# Altium schematic sheet Nordic.SchDoc: Shaheen PCB Board
size A3; Author: Mattia Sinigaglia; CompanyName: University of Bologna; DrawnBy: Mattia Sinigaglia; Organization: EES - Micrel Lab; Revision: v1; SheetNumber: 4; SheetTotal: 6
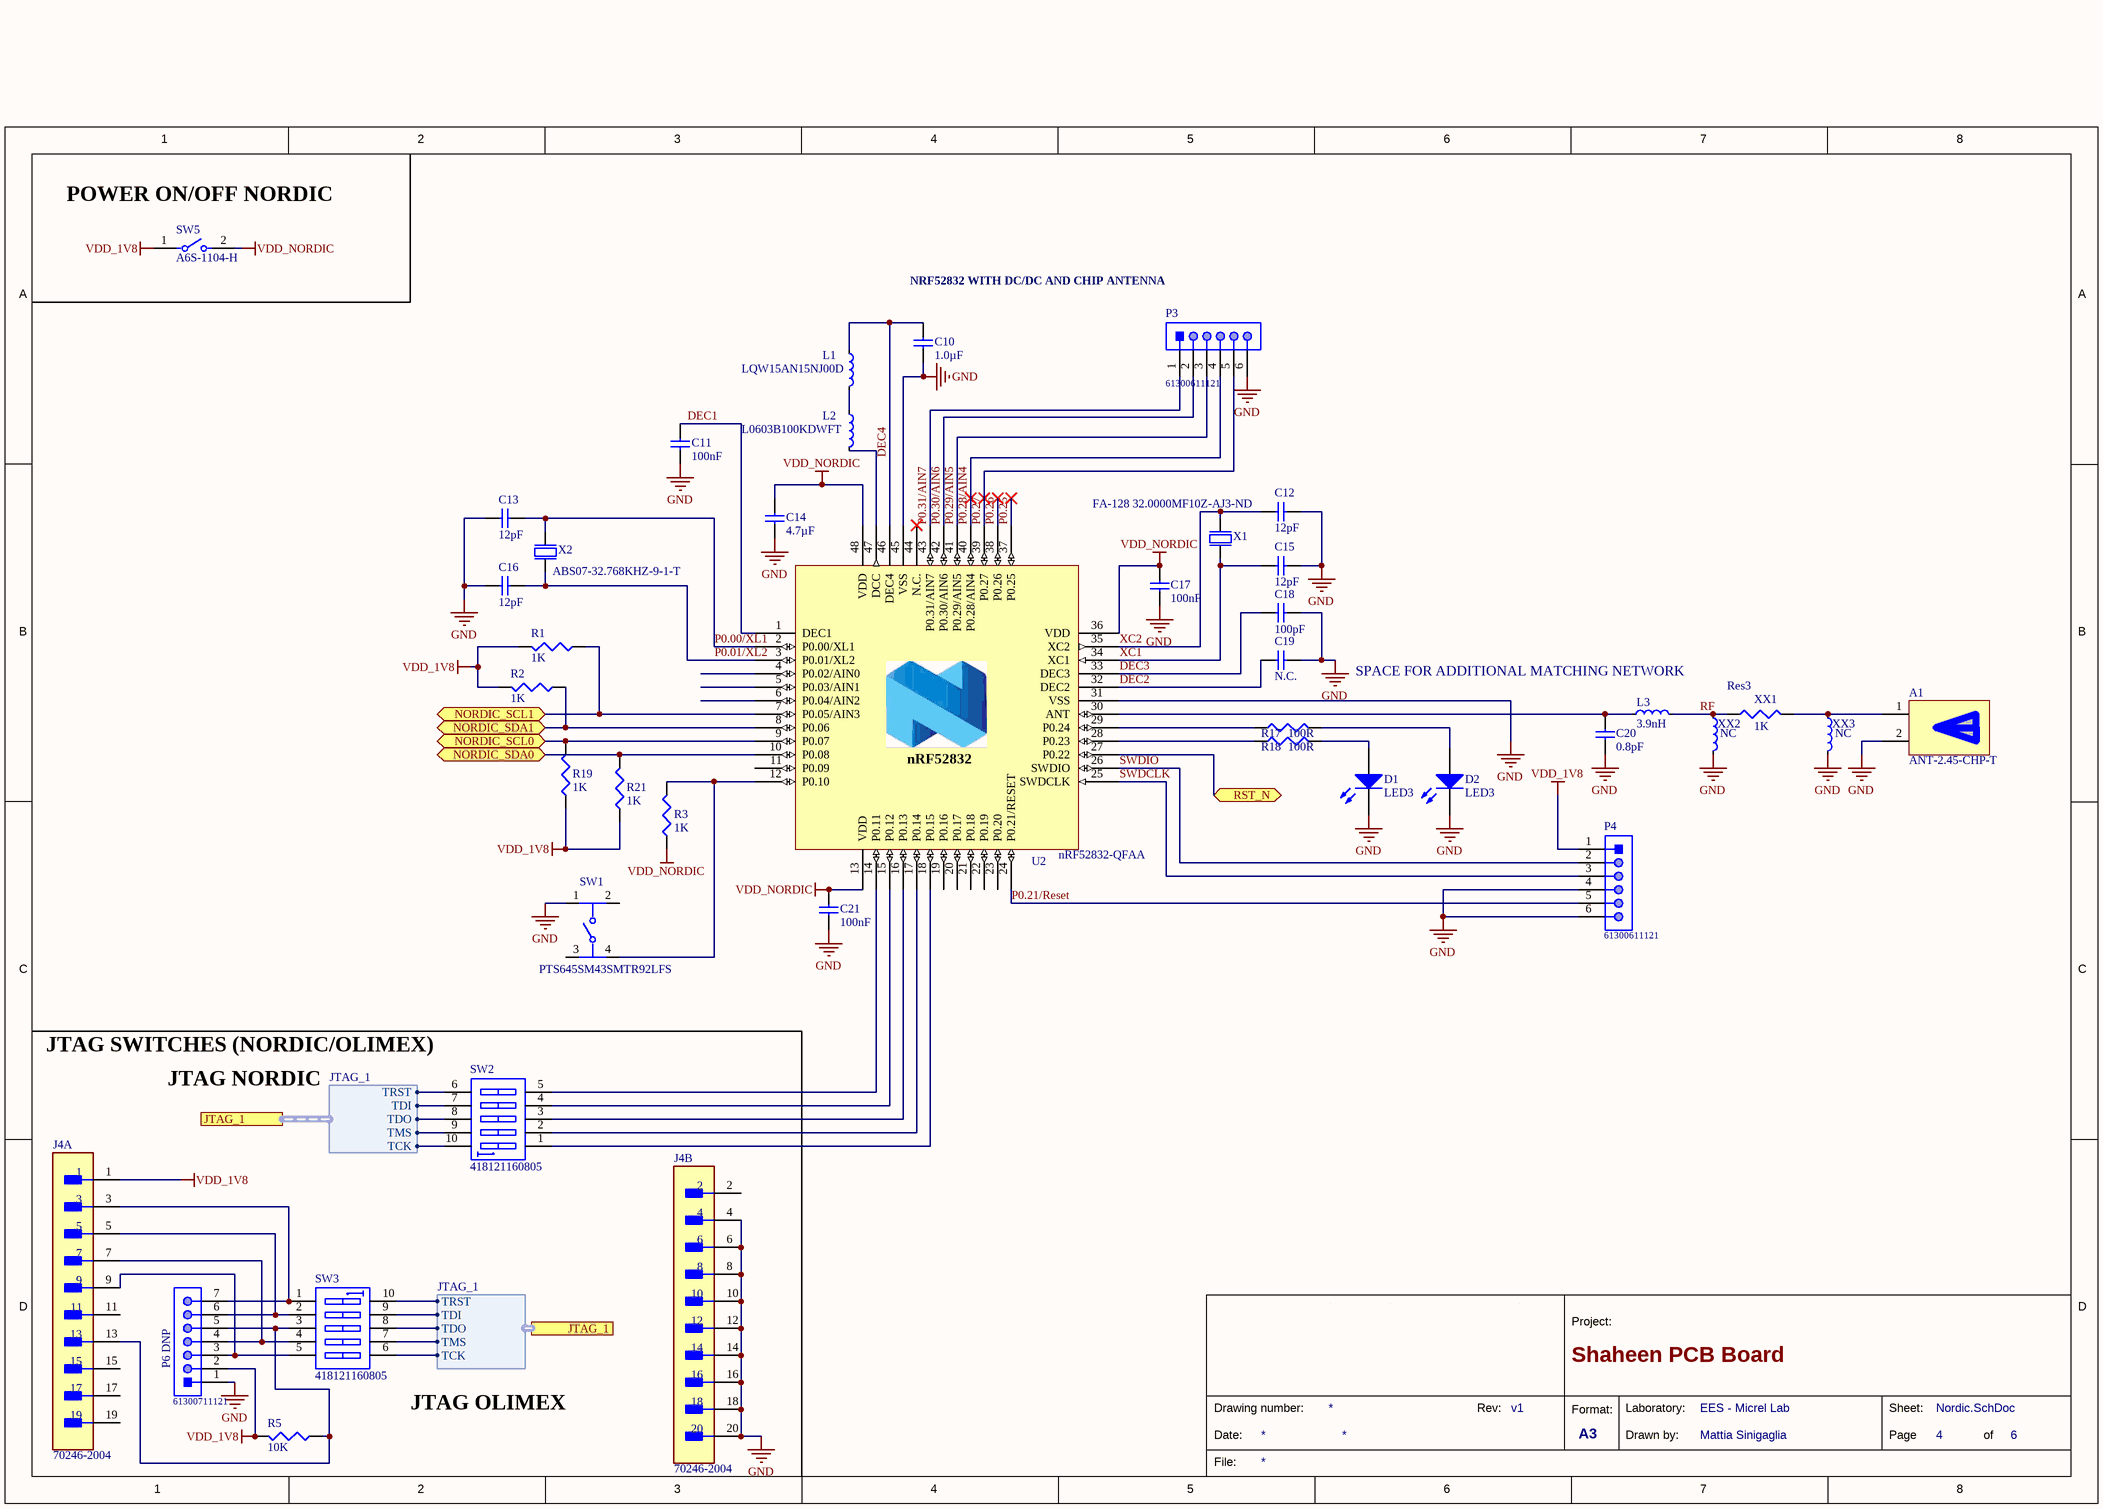
[diagram p0: Nordic.SchDoc]

## Parts
A1  ANT-2.45-CHP-T  [ANTENNACHIP]
C10  1.0µF  [CAPC1608X06L]
C11  100nF  [CAPC1005X04L]
C12  12pF  [CAPC1005X04L]
C13  12pF  [CAPC1005X04L]
C14  4.7µF  [CAPC1608X06L]
C15  12pF  [CAPC1005X04L]
C16  12pF  [CAPC1005X04L]
C17  100nF  [CAPC1005X04L]
C18  100pF  [CAPC1005X04L]
C19  N.C.  [CAPC1005X04L]
C20  0.8pF  [CAPC1005X04L]
C21  100nF  [CAPC1005X04L]
D1  LED3  [0603]
D2  LED3  [0603]
J4  70246-2004  [FP-70246-2004-MFG]  (parts A,B of 2)
L1  LQW15AN15NJ00D  [INDC1005X04L]
L2  L0603B100KDWFT  [J1-0603]
L3  3.9nH  [INDC1005X04L]
P3  61300611121  [61300611121]
P4  61300611121  [61300611121]
P6_DNP  61300711121  [61300711121]
R1  value 1K  [J1-0603]  (hidden comment: 0R)
R2  value 1K  [J1-0603]  (hidden comment: 0R)
R3  value 1K  [J1-0603]  (hidden comment: 0R)
R5  value 10K  [J1-0603]  (hidden comment: 0R)
R17  value 100R  [J1-0603]  (hidden comment: Res3)
R18  value 100R  [J1-0603]  (hidden comment: Res3)
R19  value 1K  [J1-0603]  (hidden comment: 0R)
R21  value 1K  [J1-0603]  (hidden comment: 0R)
SW1  PTS645SM43SMTR92LFS  [FP-PTS645SM43SMTR92LFS-MFG]
SW2  418121160805  [418121160805]
SW3  418121160805  [418121160805]
SW5  A6S-1104-H  [FP-A6S-1104-H-MFG]
U2  nRF52832-QFAA  [QFN40P600X600X90-48N]
X1  FA-128 32.0000MF10Z-AJ3-ND  [BT-XTAL_2016]
X2  ABS07-32.768KHZ-9-1-T  [ABS07-32.768KHZ-9-1-T]
XX1  Res3  value 1K  [J1-0603]
XX2  NC  [INDC1005X04L]
XX3  NC  [INDC1005X04L]

## Ports
JTAG_1 (harness JTAG_1), NORDIC_SCL0 (bidir), NORDIC_SCL1 (bidir), NORDIC_SDA0 (bidir), NORDIC_SDA1 (bidir), RST_N (bidir)

## Harnesses
JTAG_1: TRST, TDI, TDO, TMS, TCK

## Nets
GND: A1.2(NC) C10.1 C11.2 C12.2 C13.2 C14.2 C15.2 C16.2 C17.2 C18.2 C19.1 C20.1 C21.2 D1.2(K) D2.2(K) J4.4 J4.6 J4.8 J4.10 J4.12 J4.14 J4.16 J4.18 J4.20 P3.6 P4.4 P4.6 P6_DNP.1 SW1.1 U2.31(VSS) U2.45(VSS) U2.49(GND) X1.2(GND) X1.4(GND) XX2.2 XX3.2
VDD_1V8: J4.1 P4.1 P6_DNP.2 R1.1 R2.1 R5.1 R19.2 R21.2 SW5.1
VDD_NORDIC: C14.1 C17.1 C21.1 R3.2 SW5.2 U2.13(VDD) U2.36(VDD) U2.48(VDD)
DEC1: C11.1 U2.1(DEC1)
DEC2: C19.2 U2.32(DEC2)
DEC3: C18.1 U2.33(DEC3)
DEC4: C10.2 L1.1 U2.46(DEC4)
NORDIC_SCL0: R19.1 U2.9(P0.07) ; port NORDIC_SCL0
NORDIC_SCL1: R1.2 U2.7(P0.05/AIN3) ; port NORDIC_SCL1
NORDIC_SDA0: R21.1 U2.10(P0.08) ; port NORDIC_SDA0
NORDIC_SDA1: R2.2 U2.8(P0.06) ; port NORDIC_SDA1
P0.00/XL1: C13.1 U2.2(P0.00/XL1) X2.1(inp)
P0.01/XL2: C16.1 U2.3(P0.01/XL2) X2.2(out)
P0.21/Reset: P4.5 U2.24(P0.21/RESET)
P0.25: U2.37(P0.25)
P0.26: U2.38(P0.26)
P0.27: P3.5 U2.39(P0.27)
P0.28/AIN4: P3.4 U2.40(P0.28/AIN4)
P0.29/AIN5: P3.3 U2.41(P0.29/AIN5)
P0.30/AIN6: P3.2 U2.42(P0.30/AIN6)
P0.31/AIN7: P3.1 U2.43(P0.31/AIN7)
RF: L3.2 XX1.1 XX2.1
RST_N: U2.27(P0.22) ; port RST_N
SWDCLK: P4.3 U2.25(SWDCLK)
SWDIO: P4.2 U2.26(SWDIO)
XC1: C15.1 U2.34(XC1) X1.1(inp)
XC2: C12.1 U2.35(XC2) X1.3(out)
NetA1_1: A1.1(IN) XX1.2 XX3.1
NetC20_2: C20.2 L3.1 U2.30(ANT)
NetD1_1: D1.1(A) R18.2
NetD2_1: D2.1(A) R17.2
NetJ4_3: J4.3 P6_DNP.7 SW3.1
NetJ4_5: J4.5 P6_DNP.6 SW3.2
NetJ4_7: J4.7 P6_DNP.4 SW3.4
NetJ4_9: J4.9 P6_DNP.3 SW3.5
NetJ4_13: J4.13 P6_DNP.5 R5.2 SW3.3
NetL1_2: L1.2 L2.1
NetL2_2: L2.2 U2.47(DCC)
NetR3_1: R3.1 SW1.4 U2.12(P0.10)
NetR17_1: R17.1 U2.29(P0.24)
NetR18_1: R18.1 U2.28(P0.23)
NetSW2_1: SW2.1 U2.18(P0.15)
NetSW2_2: SW2.2 U2.17(P0.14)
NetSW2_3: SW2.3 U2.16(P0.13)
NetSW2_4: SW2.4 U2.15(P0.12)
NetSW2_5: SW2.5 U2.14(P0.11)
NetSW2_6: SW2.6 SW3.10 ; port JTAG_1.TRST
NetSW2_7: SW2.7 SW3.9 ; port JTAG_1.TDI
NetSW2_8: SW2.8 SW3.8 ; port JTAG_1.TDO
NetSW2_9: SW2.9 SW3.7 ; port JTAG_1.TMS
NetSW2_10: SW2.10 SW3.6 ; port JTAG_1.TCK

Not connected (* = marked no-connect by the designer): J4 2 11 15 17 19; SW1 2 3; U2 4(P0.02/AIN0) 5(P0.03/AIN1) 6(P0.04/AIN2) 11(P0.09) 19(P0.16) 20(P0.17) 21(P0.18) 22(P0.19) 23(P0.20) 44(N.C.)*

## Notes on the sheet
- (near SW5) POWER ON/OFF NORDIC
- NRF52832 WITH DC/DC AND CHIP ANTENNA
- SPACE FOR ADDITIONAL MATCHING NETWORK
- JTAG SWITCHES (NORDIC/OLIMEX)
- JTAG NORDIC
- JTAG OLIMEX
- 1
- 2
- 3
- 4
- 5
- 6
- 7
- 8
- A
- B
- C
- D
- Project:
- Date:
- Drawing number:
- Rev:
- Format:
- A3
- Drawn by:
- Laboratory:
- Page
- Sheet:
- of
- File:
- (in symbol nRF52832-QFAB) nRF52832

## Library data of the parts
A1 = Linx ANT-2.45-CHP-x: Amtenna; Manufacturer: Linx; Supplier PN: ANT-2.45-CHPCT-ND; Supplier: Digikey; Manufacturer PN: ANT-2.45-CHP-T
C10 = C0603-1µ0: Capacitor, X7R, ±10%; Note: 16V; Artikkelnr Noca: 20039335; Artikkelnr Simpro: N.A.; Part Number: C0603-1µ0; Manufacturer: *; Manufacturer Part Number: *; Datasheet: *; LatestRevisionDate: 2013-06-05; Pin Count: 2; Publisher: Nordic Semiconductor; Published: 2009-05-08; Value: 1.0µF; Supplier: *; Supplier part number: *; 2nd source Supplier: *; 2nd source part number: *; Footprint Doc: 0603
C11 C17 C21 = C0402-100n: Capacitor, X7R, ±10%; Note: 16V; Artikkelnr Noca: 20039200; Artikkelnr Simpro: N.A.; Part Number: C0402-100n; Manufacturer: *; Manufacturer Part Number: *; Datasheet: *; LatestRevisionDate: 2009-11-23; Pin Count: 2; Publisher: Nordic Semiconductor; Published: 2009-05-08; Value: 100nF; Supplier: *; Supplier part number: *; 2nd source Supplier: *; 2nd source part number: *; Footprint Doc: 0402
C12 C13 C15 C16 = C0402-12p: Capacitor, NP0, ±2%; Note: 50V; Artikkelnr Noca: 20029159; Artikkelnr Simpro: N.A.; Part Number: C0402-12p; Manufacturer: *; Manufacturer Part Number: *; Datasheet: *; LatestRevisionDate: 2011-05-11; Pin Count: 2; Publisher: Nordic Semiconductor; Published: 2009-05-08; Value: 12pF; Supplier: *; Supplier part number: *; 2nd source Supplier: *; 2nd source part number: *; Footprint Doc: 0402
C14 = C0603-4µ7: Capacitor, X5R, ±10%; Note: 6.3V; Artikkelnr Noca: 20069060; Artikkelnr Simpro: N.A.; Part Number: C0603-4µ7; Manufacturer: *; Manufacturer Part Number: *; Datasheet: *; LatestRevisionDate: 2009-11-23; Pin Count: 2; Publisher: Nordic Semiconductor; Published: 2009-05-08; Value: 4.7µF; Supplier: *; Supplier part number: *; 2nd source Supplier: *; 2nd source part number: *; Footprint Doc: 0603
C18 = C0402-100p: Capacitor, NP0, ±5%; Note: 50V; Artikkelnr Noca: 20029135; Artikkelnr Simpro: N.A.; Part Number: C0402-100p; Manufacturer: *; Manufacturer Part Number: *; Datasheet: *; LatestRevisionDate: 2009-05-08; Pin Count: 2; Publisher: Nordic Semiconductor; Published: 2009-05-08; Value: 100pF; Supplier: *; Supplier part number: *; 2nd source Supplier: *; 2nd source part number: *; Footprint Doc: 0402
C19 = C0402-N.C.: Not mounted; Note: Chip Cap; Artikkelnr Noca: N.A.; Part Number: C0402-N.C.; Manufacturer: *; Manufacturer Part Number: *; Datasheet: *; LatestRevisionDate: 2009-05-08; Pin Count: 2; Publisher: Nordic Semiconductor; Published: 2009-05-08; Value: N.C.; Supplier: *; Supplier part number: *; 2nd source Supplier: *; 2nd source part number: *; Footprint Doc: 0402; Artikkelnr Simpro: N.A.
C20 = C0402-0.8p: Capacitor, NP0, ±5%; Note: 50V; Artikkelnr Noca: 20029147; Artikkelnr Simpro: N.A.; Part Number: C0402-0.8p; Manufacturer: *; Manufacturer Part Number: *; Datasheet: *; LatestRevisionDate: 2012-11-21; Pin Count: 2; Publisher: Nordic Semiconductor; Published: 2009-05-08; Value: 0.8pF; Supplier: *; Supplier part number: *; 2nd source Supplier: *; 2nd source part number: *; Footprint Doc: 0402
D1 D2 = LED3: Typical BLUE SiC LED; Published: 8-Jun-2000; LatestRevisionDate: 17-Dec-2003; LatestRevisionNote: PCB Footprint replaced.; DatasheetVersion: 16-Apr-2002; PackageVersion: 16-Apr-2002; PackageReference: 3.5X2.8X1.9; Publisher: Altium Limited; PackageDescription: SM LED; 2 C-Bend Leads; Body 3.5 x 2.8 x 1.9 mm, inc leads (LxWxH typ)
J4 = CMP-04776-000337-1: CONN HEADER VERT 20POS 2.54MM; Voltage Rating (DC): 250V; Number of Contacts: 20; Current Rating: 2.5A; Glow Wire Compliant: Non-compliant; Gender: Male; Termination: Solder; Min Operating Temperature: -55°C; Voltage Rating: 250V; Series: 70246; Orientation: Vertical; Radiation Hardening: No; Contact Material: Gold; Number of Circuits: 20; Packaging: Tray; Flammability Rating: UL94 V-0; Contact Plating: Gold; Max Voltage Rating (DC): 250V; Package Quantity: 720; ELV: Compliant; Max Operating Temperature: 120°C; Number of Positions: 20; Number of Rows: 2; Pitch: 2.54mm; Mount: Through Hole
L1 = L0402-15n: High frequency chip inductor ±10%; Manufacturer: Taiyo Yuden; Manufacturer Part Number: HK100515NJ-T; 2nd source part number: 658-1328; Value: 15nH; Artikkelnr Noca: 33029323; Artikkelnr Simpro: N.A.; Part Number: L0402-15n; LatestRevisionDate: 2012-09-19; Pin Count: 2; Publisher: Nordic Semiconductor; Published: 2010-07-12; Note: High frequency chip inductor ±10%; Supplier: Digi-Key; Datasheet: http://www.yuden.co.jp/productdata/catalog/en/mlci04_e.pdf; Supplier part number: 587-1521-1-ND; 2nd source Supplier: Farnell; Footprint Doc: 0402
L2 = L0603-10µ: Chip inductor, IDC,min = 50 mA, ±20%; Manufacturer: Taiyo Yuden; Manufacturer Part Number: LBMF1608T100K; 2nd source part number: 178-6105; Value: 10µH; Note: LBMF1608T100K 10µH 80mA 0603; Artikkelnr Noca: 33029314; Artikkelnr Simpro: N.A.; Part Number: L0603-10µ; Datasheet: http://www.yuden.co.jp/ut/product/pdf/elb2_e.pdf; LatestRevisionDate: 2012-09-19; Pin Count: 2; Publisher: Nordic Semiconductor; Published: 2010-02-24; Supplier: Digi-Key; Supplier part number: 587-1714-1-ND; 2nd source Supplier: Farnell; Footprint Doc: 0603
L3 = L0402-3n9: High frequency chip inductor ±5%; Manufacturer: Murata; Manufacturer Part Number: LQP15MN3N9B02D; Artikkelnr Noca: 33029151; Artikkelnr Simpro: N.A.; Part Number: L0402-3n9; Datasheet: http://search.murata.co.jp/Ceramy/image/img/PDF/ENG/L0075S0084LQP15M.pdf; LatestRevisionDate: 2012-09-19; Pin Count: 2; Publisher: Nordic Semiconductor; Published: 2009-05-08; Value: 3.9nH; Note: High frequency chip inductor ±5%; Supplier: Digi-Key; Supplier part number: 490-1131-1-ND; 2nd source Supplier: *; 2nd source part number: *; Footprint Doc: 0402
P3 P4 = CMP-1502-01070-1: THT Vertical Pin Header WR-PHD, Pitch 2.54 mm, Single Row, 6 pins; Manufacturer: Wurth Elektronik; Gender: Male; Pin Number: 6; Pitch: 2.54mm; Working Voltage: 250VAC; Rated Current: 3A; Withstanding Voltage: 500VAC; Contact Resistance: 20mOhm; Operating Temperature: -40to105degC; Packaging: Bag; Datasheet URL: https://katalog.we-online.de/em/datasheet/6130xx11121.pdf; Package Reference: 61300611121; Mounting Technology: THT; Publisher: WurthElektronik; Part Number: 61300611121; Manufacturer URL: http://www.we-online.de; Row Number: Single; Orientation: Vertical
P6_DNP = CMP-1502-01074-1: THT Vertical Pin Header WR-PHD, Pitch 2.54 mm, Single Row, 7 pins; Manufacturer: Wurth Elektronik; Pin Number: 7; Gender: Male; Working Voltage: 250VAC; Contact Resistance: 20mOhm; Rated Current: 3A; Pitch: 2.54mm; Withstanding Voltage: 500VAC; Row Number: Single; Packaging: Bag; Orientation: Vertical; Manufacturer URL: http://www.we-online.de; Datasheet URL: https://katalog.we-online.de/em/datasheet/6130xx11121.pdf; Part Number: 61300711121; Publisher: WurthElektronik; Operating Temperature: -40to105degC; Mounting Technology: THT; Package Reference: 61300711121
R1-R3 R5 R17-R19 R21 XX1 = Res3: Resistor; Published: 8-Jun-2000; LatestRevisionDate: 29-May-2009; LatestRevisionNote: IPC-7351 Footprint Added.; PackageReference: J1-0603; Publisher: Altium Limited; PackageDescription: Chip Resistor
SW1 = CMP-2000-05160-2: SWITCH TACTILE SPST-NO 0.05A 12V; Contact Resistance: 100mR; Throw Configuration: SPST; Illumination Type: Non-Illuminated; Mechanical Life: 100000Cycles; Current Rating: 50mA; Switch Function: Off-Mom; Actuator Length: 0.85mm; Actuator Material: Nylon; Actuator Type: Standard; Operating Force: 160gf; Min Operating Temperature: -20°C; REACH SVHC: No SVHC; Termination: Gull Wing; Case/Package: SMD/SMT; Packaging: Tape and Reel; Mount: Surface Mount; Voltage Rating (DC): 12V; Orientation: Straight; Lead Free: Lead Free; Contact Material: Silver; Color: Black; Max Current Rating: 50mA; Contact Plating: Silver; Depth: 9mm; Package Quantity: 1; Max Voltage Rating (DC): 12V; Length: 6mm; Max Operating Temperature: 60°C
SW2 SW3 = CMP-1437-00005-1: WS-DISV 2.54 mm small compact SMD Dip Switch with top tape; Manufacturer: Wuerth Elektronik; NoPins: 10; ComponentLink1Description: Manufacturer URL; ComponentLink1URL: http://www.we-online.com; ComponentLink2Description: Datasheet; ComponentLink2URL: http://katalog.we-online.de/em/datasheet/4181211608xx.pdf; PackageReference: 418121160805; PartNumber: 418121160805
SW5 = CMP-08827-000005-1: SWITCH SLIDE DIP SPST 25MA 24V; Manufacturer: Omron Electronics Inc-EMC Div; Throw Configuration: SPST-NO; Standoff Height: 0mm; Number Of Circuits: 1; Electromechanical Life: 1000Cycles; Contact Resistance: 200mΩ; Digikey Description: SWITCH SLIDE DIP SPST 25MA 24V; ComponentLink2Description: Datasheet; Mount: Surface Mount; Manufacturer Part Number: A6S-1104-H; ComponentLink2URL: https://omronfs.omron.com/en_US/ecb/products/pdf/en-a6s.pdf; Category: Switch; Height: 3.95mm; Device Class L3: DIP Switches; Octopart: https://octopart.com/a6s-1104-h-omron-55410938; Mouser Description: DIP Switches / SIP Switches Dip Switch; Lead Free: Yes; Temperature Range Low: -20°C; Temperature Range High: +70°C; Automotive: No; Ambient Temperature Range Low: -20°C; Ambient Temperature Range High: +70°C; Voltage Rating Dc: 24V; Device Class L2: Switches; RoHS: TRUE; Package: 0; Contact Current Rating: 25mA; Device Class L1: Electromechanical; Temperature: -20°C to +70°C
U2 = nRF52832-QFAB: Multi-protocol Bluetooth Low Energy, ANT and 2.4GHz proprietary system-on-chip; Manufacturer: Nordic Semiconductor; Artikkelnr Noca: N.A.; Part Number: nRF52832-QFAA; Manufacturer Part Number: nRF52832-QFAA; Datasheet: *; LatestRevisionDate: 2016-11-24; Pin Count: 48; Publisher: Nordic Semiconductor; Published: 2016-11-24; Value: nRF52832-QFAA; Note: *; Supplier: Nordic Semiconductor; Supplier part number: *; 2nd source Supplier: *; 2nd source part number: *; Footprint Doc: QFN-48; Artikkelnr Simpro: N.A.
X1 = XTAL_SMD2016_32MHz_8pF_General: XTAL SMD 2016, 32MHz, Cl=8pF, Total Tol: ±40ppm; Note: XTAL SMD 32.000MHz; Artikkelnr Noca: N.A.; Part Number: XTAL_SMD2016_32MHz_8pF_General; Manufacturer: *; Manufacturer Part Number: *; Datasheet: *; LatestRevisionDate: 2016-08-19; Pin Count: 4; Publisher: Nordic Semiconductor; Published: 2016-08-19; Value: 32MHz; Supplier: *; Supplier part number: *; 2nd source Supplier: *; 2nd source part number: *; Footprint Doc: XTAL_2016; Artikkelnr Simpro: N.A.
X2 = XTAL_SMD3215_32.768kHz_9pF_General: XTAL SMD 3215, 32.768kHz, Cl=9pF, Total Tol: ±50ppm; Note: XTAL SMD 32.768kHz; Artikkelnr Noca: N.A.; Part Number: XTAL_SMD3215_32.768kHz_9pF_General; Manufacturer: *; Manufacturer Part Number: *; Datasheet: *; LatestRevisionDate: 2016-08-19; Pin Count: 2; Publisher: Nordic Semiconductor; Published: 2016-08-19; Value: 32.768kHz; Supplier: *; Supplier part number: *; 2nd source Supplier: *; 2nd source part number: *; Footprint Doc: XTAL_3215; Artikkelnr Simpro: N.A.
XX2 XX3 = L0402-N.C.: Not mounted; Value: N.C.; Artikkelnr Noca: N.A.; Assembly: Not mounted; Part Number: L0402-N.C.; Manufacturer: *; Manufacturer Part Number: *; Datasheet: *; LatestRevisionDate: 2016-11-24; Pin Count: 2; Publisher: Nordic Semiconductor; Published: 2016-11-24; Note: *; Supplier: *; Supplier part number: *; 2nd source Supplier: *; 2nd source part number: *; Footprint Doc: 0402; Artikkelnr Simpro: N.A.; ComponentLink1Description: Datasheet; ComponentLink2Description: Supplier link